# Altium schematic sheet Block Diagram.SchDoc: Block Diagram
size A4; DocumentNumber: 1; SheetNumber: 1; SheetTotal: 2
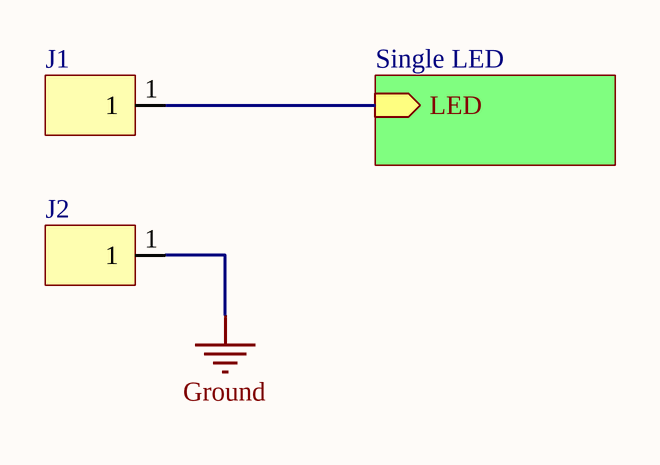
[diagram p0: Block Diagram.SchDoc]

## Parts
J1  Connector Breadboard 1-Pin  [Connector Samtec HW Series 1-Pin]  (value not drawn)
J2  Connector Breadboard 1-Pin  [Connector Samtec HW Series 1-Pin]  (value not drawn)

## Sub-sheets
Single LED = Single LED.SchDoc: LED (in)

## Nets
Ground: J2.1
NetJ1_1: J1.1 ; sheet Single LED/LED

## Library data of the parts
J1 J2 = Connector Breadboard 1-Pin: Manufacturer: Samtec; Manufacturer Part Number: HW-01-08-G-S-200-265; Process Type: THT; Max Operating Temperature: 125ºC; Min Operating Temperature: -55ºC